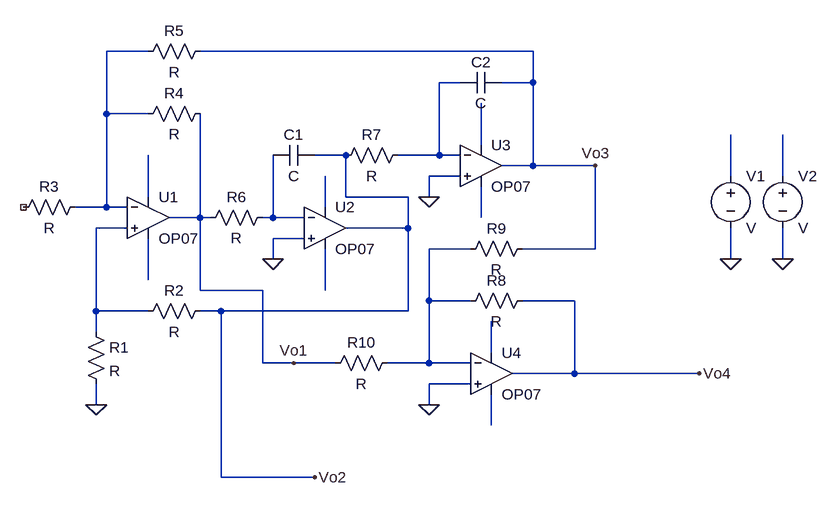
[diagram p0: schematic Draft3.asc]
Draft3.asc, the LTspice schematic file:
Version 4
SHEET 1 1112 680
WIRE 80 -128 16 -128
WIRE 672 -128 160 -128
WIRE 560 -80 528 -80
WIRE 672 -80 672 -128
WIRE 672 -80 624 -80
WIRE 16 -32 16 -128
WIRE 80 -32 16 -32
WIRE 592 16 592 -48
WIRE 384 32 336 32
WIRE 528 32 528 -80
WIRE 528 32 464 32
WIRE 560 32 528 32
WIRE 672 48 672 -80
WIRE 672 48 624 48
WIRE 768 48 672 48
WIRE 560 64 512 64
WIRE 976 64 976 0
WIRE 1056 64 1056 0
WIRE 80 96 80 32
WIRE 384 96 384 32
WIRE 480 96 384 96
WIRE 512 96 512 64
WIRE 16 112 16 -32
WIRE 16 112 -32 112
WIRE 48 112 16 112
WIRE 352 112 352 64
WIRE 160 128 160 -32
WIRE 160 128 112 128
WIRE 176 128 160 128
WIRE 272 128 272 32
WIRE 272 128 256 128
WIRE 320 128 272 128
WIRE 592 128 592 80
WIRE 48 144 0 144
WIRE 480 144 480 96
WIRE 480 144 384 144
WIRE 320 160 272 160
WIRE 576 176 512 176
WIRE 768 176 768 48
WIRE 768 176 656 176
WIRE 272 192 272 160
WIRE 976 192 976 144
WIRE 1056 192 1056 144
WIRE 80 224 80 160
WIRE 160 240 160 128
WIRE 256 240 160 240
WIRE 352 240 352 176
WIRE 512 256 512 176
WIRE 576 256 512 256
WIRE 736 256 656 256
WIRE 0 272 0 144
WIRE 80 272 0 272
WIRE 192 272 160 272
WIRE 480 272 480 144
WIRE 480 272 192 272
WIRE 0 304 0 272
WIRE 608 336 608 288
WIRE 256 352 256 240
WIRE 304 352 256 352
WIRE 368 352 304 352
WIRE 512 352 512 256
WIRE 512 352 448 352
WIRE 576 352 512 352
WIRE 736 368 736 256
WIRE 736 368 640 368
WIRE 928 368 736 368
WIRE 576 384 512 384
WIRE 0 416 0 384
WIRE 512 416 512 384
WIRE 608 448 608 400
WIRE 192 528 192 272
WIRE 336 528 192 528
FLAG 0 416 0
FLAG 512 416 0
FLAG 512 96 0
FLAG 272 192 0
FLAG 336 528 Vo2
FLAG 928 368 Vo4
FLAG 304 352 Vo1
FLAG 768 48 Vo3
FLAG 976 192 0
FLAG 1056 192 0
SYMBOL OpAmps\\OP07 80 64 R0
SYMATTR InstName U1
SYMBOL OpAmps\\OP07 352 80 R0
SYMATTR InstName U2
SYMBOL OpAmps\\OP07 592 -16 R0
SYMATTR InstName U3
SYMBOL OpAmps\\OP07 608 304 R0
SYMATTR InstName U4
SYMBOL res -16 288 R0
SYMATTR InstName R1
SYMBOL res 176 256 R90
WINDOW 0 0 56 VBottom 2
WINDOW 3 32 56 VTop 2
SYMATTR InstName R2
SYMBOL res -16 96 R90
WINDOW 0 0 56 VBottom 2
WINDOW 3 32 56 VTop 2
SYMATTR InstName R3
SYMBOL res 176 -48 R90
WINDOW 0 0 56 VBottom 2
WINDOW 3 32 56 VTop 2
SYMATTR InstName R4
SYMBOL res 176 -144 R90
WINDOW 0 0 56 VBottom 2
WINDOW 3 32 56 VTop 2
SYMATTR InstName R5
SYMBOL res 272 112 R90
WINDOW 0 0 56 VBottom 2
WINDOW 3 32 56 VTop 2
SYMATTR InstName R6
SYMBOL cap 272 16 M90
WINDOW 0 0 32 VBottom 2
WINDOW 3 32 32 VTop 2
SYMATTR InstName C1
SYMBOL res 480 16 R90
WINDOW 0 0 56 VBottom 2
WINDOW 3 32 56 VTop 2
SYMATTR InstName R7
SYMBOL cap 624 -96 R90
WINDOW 0 0 32 VBottom 2
WINDOW 3 32 32 VTop 2
SYMATTR InstName C2
SYMBOL res 672 240 R90
WINDOW 0 0 56 VBottom 2
WINDOW 3 32 56 VTop 2
SYMATTR InstName R8
SYMBOL res 672 160 R90
WINDOW 0 0 56 VBottom 2
WINDOW 3 32 56 VTop 2
SYMATTR InstName R9
SYMBOL res 464 336 R90
WINDOW 0 0 56 VBottom 2
WINDOW 3 32 56 VTop 2
SYMATTR InstName R10
SYMBOL voltage 976 48 R0
SYMATTR InstName V1
SYMBOL voltage 1056 48 R0
SYMATTR InstName V2

The netlist it stands for:
* Draft3.asc
XU1 N010 N001 N006 N012 Vo1 LT1001  ; OP07, pins In+ In- V+ V- OUT
XU2 0 N008 N007 N013 Vo2 LT1001  ; OP07, pins In+ In- V+ V- OUT
XU3 0 N002 N003 N009 Vo3 LT1001  ; OP07, pins In+ In- V+ V- OUT
XU4 0 N011 N014 N015 Vo4 LT1001  ; OP07, pins In+ In- V+ V- OUT
R1 N010 0 R
R2 Vo2 N010 R
R3 N001 NC_01 R
R4 Vo1 N001 R
R5 Vo3 N001 R
R6 N008 Vo1 R
C1 N008 Vo2 C
R7 N002 Vo2 R
C2 Vo3 N002 C
R8 Vo4 N011 R
R9 Vo3 N011 R
R10 N011 Vo1 R
V1 N004 0 V
V2 N005 0 V
.lib LTC.lib
.backanno
.end